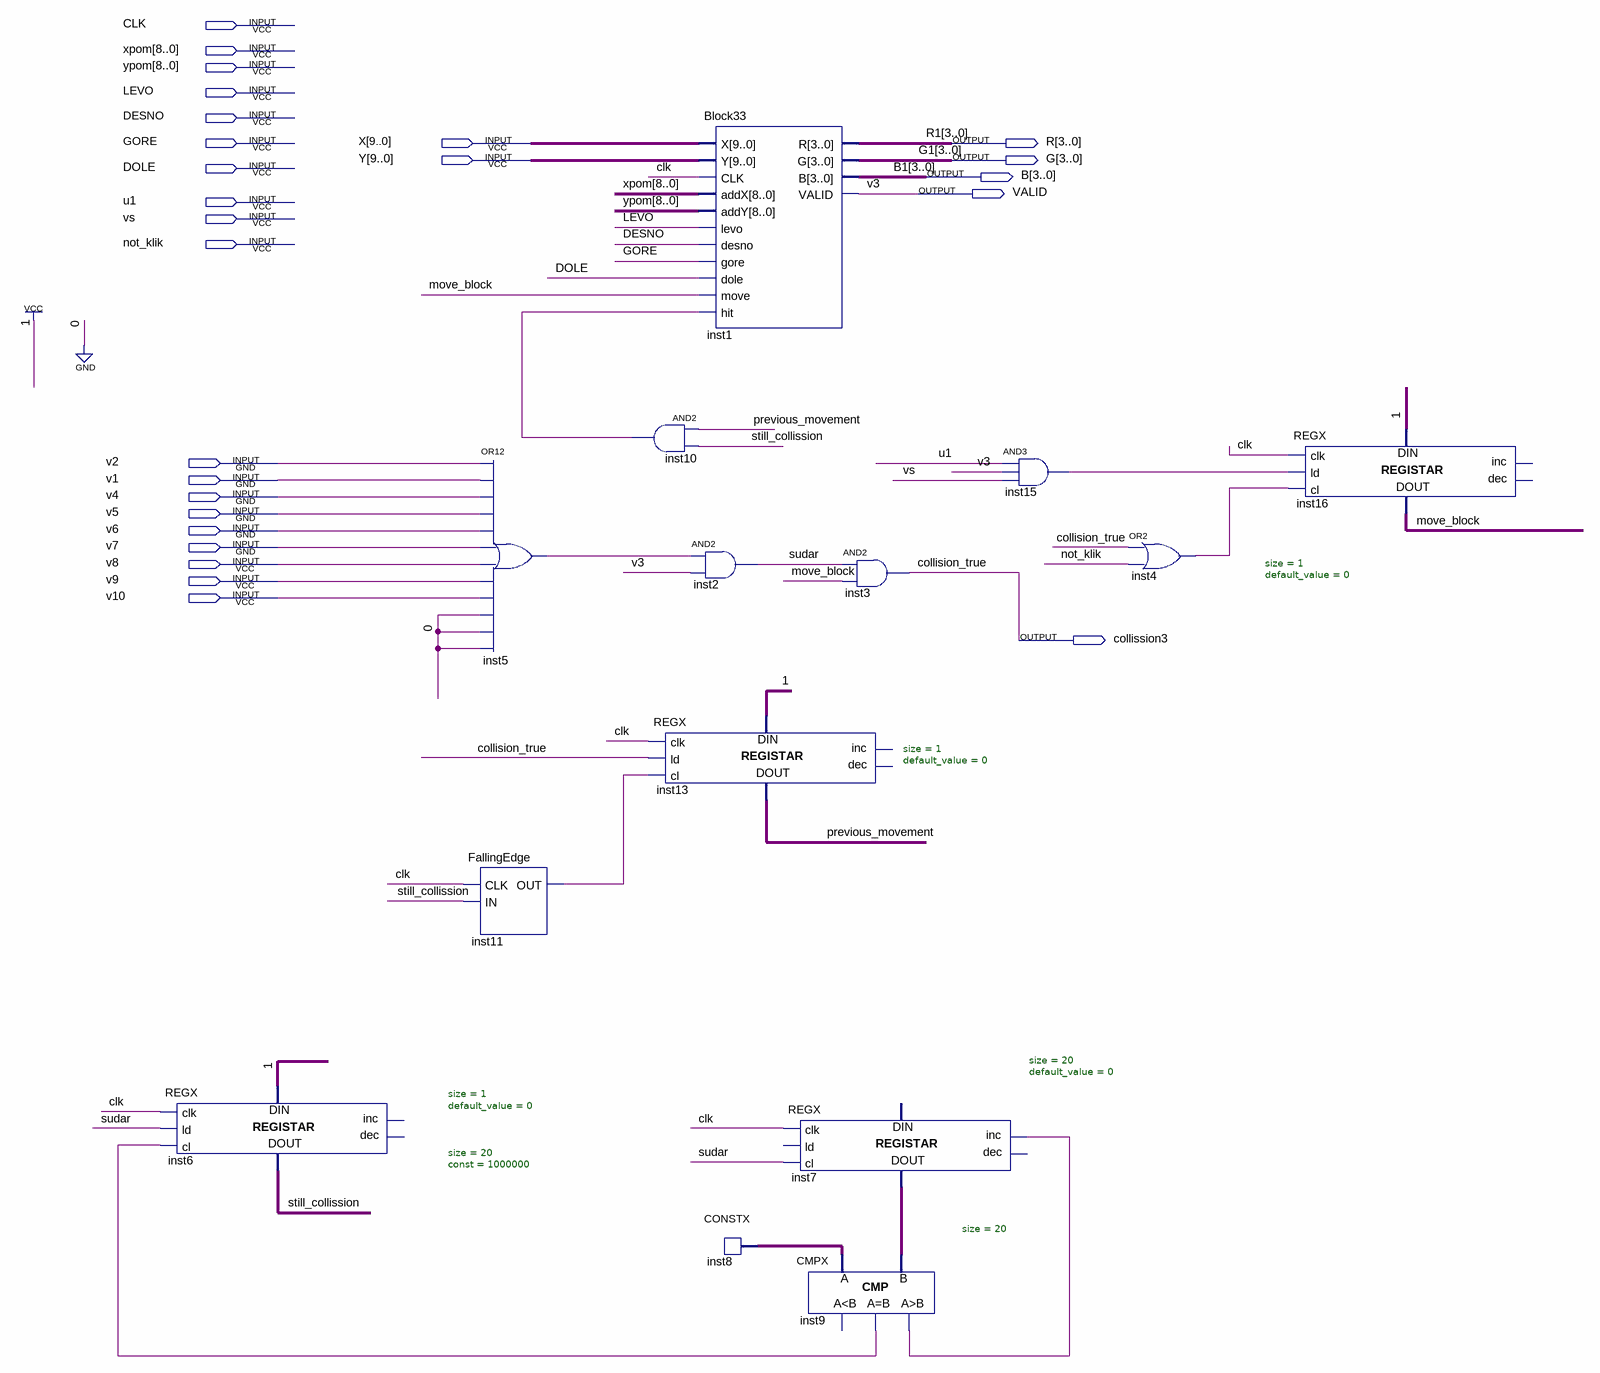
[diagram p0: schematic sheet]
// Quartus schematic blok33sema.bdf as structural Verilog: 14 symbols, 26 pins
module blok33sema (
  input  CLK,
  input  [8:0] xpom,
  input  [8:0] ypom,
  input  LEVO,
  input  DESNO,
  input  GORE,
  input  [9:0] X,
  input  [9:0] Y,
  input  DOLE,
  input  u1,
  input  vs,
  input  not_klik,
  input  v2,
  input  v1,
  input  v4,
  input  v5,
  input  v6,
  input  v7,
  input  v8,
  input  v9,
  input  v10,
  output [3:0] R,
  output [3:0] G,
  output [3:0] B,
  output VALID,
  output collission3
);

  wire inst4_out, inst5_out, inst9_eq, inst9_gr, inst10_out, inst11_out, inst15_out, move_block,
       previous_movement, still_collission, sudar;
  wire [19:0] inst7_data_out, inst8_data;

  REGX #(.size(1), .default_value(0)) inst6 (
    .clk(CLK), .ld(sudar), .cl(inst9_eq), .data_in(1'b1), .data_out(still_collission));  // open: inc, dec
  or inst5 (inst5_out, v2, v1, v4, v5, v6, v7, v8, v9, v10, 1'b0, 1'b0, 1'b0);
  FallingEdge inst11 (.CLK(CLK), .IN(still_collission), .OUT(inst11_out));
  and inst10 (inst10_out, previous_movement, still_collission);
  Block33 inst1 (
    .X(X), .Y(Y), .CLK(CLK), .addX(xpom), .addY(ypom), .levo(LEVO), .desno(DESNO), .gore(GORE), .dole(DOLE),
    .move(move_block), .hit(inst10_out), .R(R), .G(G), .B(B), .VALID(VALID));
  and inst2 (sudar, inst5_out, VALID);
  REGX #(.size(1), .default_value(0)) inst13 (
    .clk(CLK), .ld(collission3), .cl(inst11_out), .data_in(1'b1), .data_out(previous_movement));  // open: inc, dec
  CONSTX #(.size(20), .\const (1000000)) inst8 (.data(inst8_data));
  REGX #(.size(20), .default_value(0)) inst7 (
    .clk(CLK), .cl(sudar), .inc(inst9_gr), .data_out(inst7_data_out));  // open: ld, dec, data_in
  CMPX #(.size(20)) inst9 (.A(inst8_data), .B(inst7_data_out), .eq(inst9_eq), .gr(inst9_gr));  // open: ls
  and inst3 (collission3, sudar, move_block);
  and inst15 (inst15_out, u1, VALID, vs);
  or inst4 (inst4_out, collission3, not_klik);
  REGX #(.size(1), .default_value(0)) inst16 (
    .clk(CLK), .ld(inst15_out), .cl(inst4_out), .data_in(1'b1), .data_out(move_block));  // open: inc, dec

  // Other names for the same wires on the sheet: B1[3:0] = B; collision_true = collission3; G1[3:0] = G; R1[3:0] = R;
  //   v3 = VALID
endmodule
